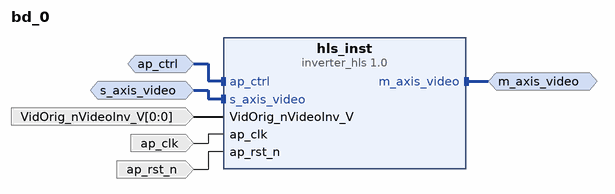
[diagram p0: block diagram of the top level]
# Vivado block design bd_0, xc7vx485tffg1157-1, Vivado 2019.2
create_bd_design bd_0

create_bd_intf_port -mode Slave -vlnv xilinx.com:interface:acc_handshake_rtl:1.0 ap_ctrl
create_bd_intf_port -mode Master -vlnv xilinx.com:interface:axis_rtl:1.0 m_axis_video
set_property -dict {CONFIG.FREQ_HZ 100000000.0} [get_bd_intf_ports m_axis_video]
create_bd_intf_port -mode Slave -vlnv xilinx.com:interface:axis_rtl:1.0 s_axis_video
set_property -dict [list \
  CONFIG.TDATA_NUM_BYTES 1 \
  CONFIG.TDEST_WIDTH 1 \
  CONFIG.TID_WIDTH 1 \
  CONFIG.TUSER_WIDTH 1 \
  CONFIG.HAS_TREADY 1 \
  CONFIG.HAS_TSTRB 1 \
  CONFIG.HAS_TKEEP 1 \
  CONFIG.HAS_TLAST 1 \
  CONFIG.FREQ_HZ 100000000.0 \
  CONFIG.LAYERED_METADATA undef \
] [get_bd_intf_ports s_axis_video]
create_bd_port -dir I -from 0 -to 0 -type data VidOrig_nVideoInv_V
create_bd_port -dir I -type clk ap_clk
set_property -dict {CONFIG.FREQ_HZ 100000000.0} [get_bd_ports ap_clk]
create_bd_port -dir I -type rst ap_rst_n

create_bd_cell -type ip -vlnv xilinx.com:hls:inverter_hls:1.0 hls_inst

# ---- connections ----

connect_bd_intf_net -intf_net ap_ctrl_0_1 [get_bd_intf_ports ap_ctrl] [get_bd_intf_pins hls_inst/ap_ctrl]
connect_bd_intf_net [get_bd_intf_ports m_axis_video] [get_bd_intf_pins hls_inst/m_axis_video]
connect_bd_intf_net -intf_net s_axis_video_0_1 [get_bd_intf_ports s_axis_video] [get_bd_intf_pins hls_inst/s_axis_video]
connect_bd_net -net VidOrig_nVideoInv_V_0_1 [get_bd_ports VidOrig_nVideoInv_V] [get_bd_pins hls_inst/VidOrig_nVideoInv_V]
connect_bd_net -net ap_clk_0_1 [get_bd_ports ap_clk] [get_bd_pins hls_inst/ap_clk]
connect_bd_net -net ap_rst_n_0_1 [get_bd_ports ap_rst_n] [get_bd_pins hls_inst/ap_rst_n]

validate_bd_design
save_bd_design
